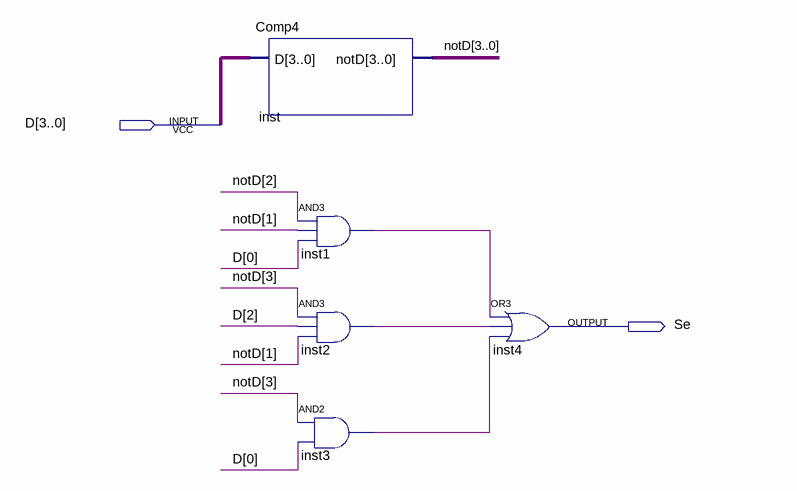
[diagram p0: schematic sheet]
// Quartus schematic Se.bdf as structural Verilog: 5 symbols, 2 pins
module Se (
  input  [3:0] D,
  output Se
);

  wire inst1_out, inst2_out, inst3_out;
  wire [3:0] notD;

  Comp4 inst (.D(D), .notD(notD));
  and inst1 (inst1_out, notD[2], notD[1], D[0]);
  and inst2 (inst2_out, notD[3], D[2], notD[1]);
  and inst3 (inst3_out, notD[3], D[0]);
  or inst4 (Se, inst1_out, inst2_out, inst3_out);
endmodule
